# Altium schematic sheet gates.SchDoc
size A4; PageSetup: Record=PageOptions|CenterHorizontal=True|CenterVertical=True|PrintScale=1.00|XCorrection=1.00|YCorrection=1.00|PrintKind=1|BorderSize=5000000|LeftOffset=0|BottomOffset=0|Orientation=2|PaperLength=1000|PaperWidth=1000|Scale=100|PaperSource=7|PrintQuality=-4|MediaType=1|DitherType=10|PaperKind=A3|PrintScaleMode=1
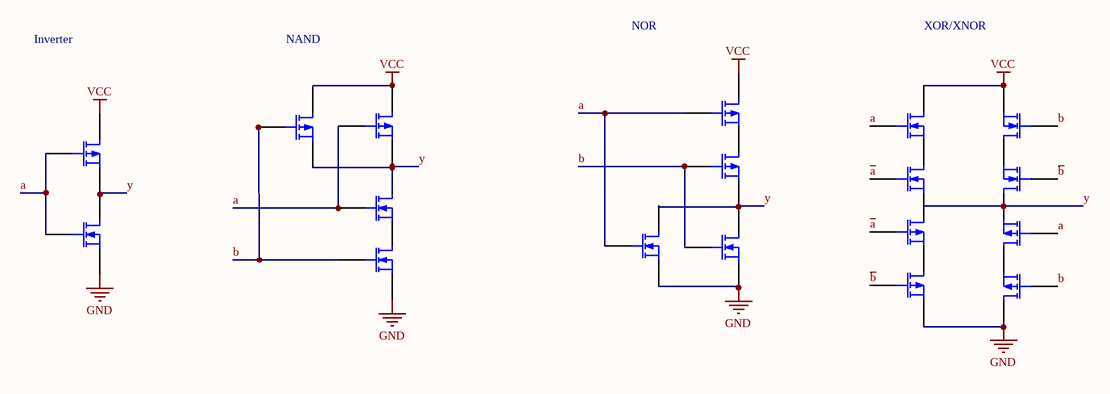
[diagram p0: gates.SchDoc]

## Parts
(Parts that share a designator on the sheet are numbered #1, #2 ... from top to bottom, then left to right.)
?#1  (no value)  [BCY-W3/B.8]
?#2  (no value)  [BCY-W3/B.8]
?#3  (no value)  [BCY-W3/B.8]
?#4  (no value)  [BCY-W3/B.8]
?#5  (no value)  [BCY-W3/B.8]
?#6  (no value)  [BCY-W3/B.8]
?#7  (no value)  [BCY-W3/B.8]
?#8  (no value)  [BCY-W3/B.8]
?#9  (no value)  [BCY-W3/B.8]
?#10  (no value)  [BCY-W3/B.8]
?#11  (no value)  [BCY-W3/B.8]
?#12  (no value)  [BCY-W3/B.8]
?#13  (no value)  [BCY-W3/B.8]
?#14  (no value)  [BCY-W3/B.8]
?#15  (no value)  [BCY-W3/B.8]
?#16  (no value)  [BCY-W3/B.8]
?#17  (no value)  [BCY-W3/B.8]
?#18  (no value)  [BCY-W3/B.8]

## Nets
GND: ?#11.3(S) ?#13.3(S) ?#14.3(S) ?#15.3(S) ?#17.3(S) ?#18.1(D)
VCC: ?#1.1(D) ?#3.1(D) ?#4.1(D) ?#5.1(D) ?#6.3(S)
a: ?#1.2(G) ?#3.2(G) ?#4.2(G) ?#5.2(G) ?#9.2(G) ?#11.2(G) ?#13.2(G) ?#16.2(G)
~{a}: ?#8.2(G) ?#12.2(G)
b: ?#2.2(G) ?#6.2(G) ?#7.2(G) ?#14.2(G) ?#15.2(G) ?#18.2(G)
~{b}: ?#10.2(G) ?#17.2(G)
y: ?#2.3(S) ?#3.3(S) ?#5.3(S) ?#7.3(S) ?#9.1(D) ?#11.1(D) ?#13.1(D) ?#14.1(D)

Not connected (* = marked no-connect by the designer): ?#1 3(S); ?#2 1(D); ?#4 3(S); ?#6 1(D); ?#7 1(D); ?#8 1(D) 3(S); ?#9 3(S); ?#10 1(D) 3(S); ?#12 1(D) 3(S); ?#15 1(D); ?#16 1(D) 3(S); ?#17 1(D); ?#18 3(S)

## Notes on the sheet
- Inverter
- NAND
- NOR
- XOR/XNOR

## Library data of the parts
?#1-?#3 ?#5 ?#7 ?#12 ?#16-?#18 = MOSFET-P: P-Channel MOSFET; Published: 8-Jun-2000; LatestRevisionDate: 17-Jul-2002; LatestRevisionNote: Re-released for DXP Platform.; PackageVersion: 1995/1996; PackageReference: E3; Publisher: Altium Limited
?#4 ?#6 ?#8-?#11 ?#13-?#15 = MOSFET-N: N-Channel MOSFET; Published: 8-Jun-2000; LatestRevisionDate: 17-Jul-2002; LatestRevisionNote: Re-released for DXP Platform.; PackageVersion: 1995/1996; PackageReference: E3; Publisher: Altium Limited